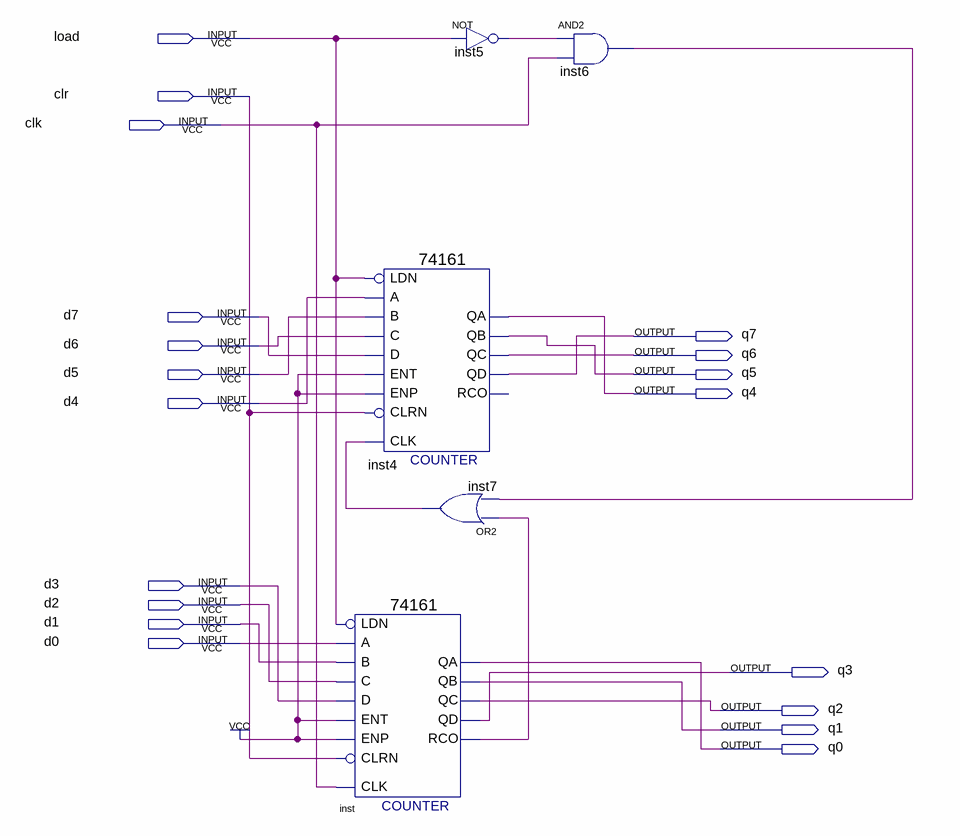
[diagram p0: schematic sheet]
// Quartus schematic newcounter.bdf as structural Verilog: 5 symbols, 19 pins
module newcounter (
  input  load,
  input  clr,
  input  clk,
  input  d7,
  input  d6,
  input  d5,
  input  d4,
  input  d3,
  input  d2,
  input  d1,
  input  d0,
  output q7,
  output q6,
  output q5,
  output q4,
  output q3,
  output q2,
  output q1,
  output q0
);

  wire inst5_out, inst6_out, inst7_out, inst_rco;

  \74161  inst4 (
    .CLRN(clr), .CLK(inst7_out), .ENP(1'b1), .LDN(load), .A(d4), .D(d7), .ENT(1'b1), .B(d5), .C(d6), .QD(q7),
    .QC(q6), .QB(q5), .QA(q4));  // open: RCO
  \74161  inst (
    .CLRN(clr), .CLK(clk), .ENP(1'b1), .LDN(load), .A(d0), .D(d3), .ENT(1'b1), .B(d1), .C(d2), .QD(q3),
    .QC(q2), .QB(q1), .QA(q0), .RCO(inst_rco));
  or inst7 (inst7_out, inst_rco, inst6_out);
  not inst5 (inst5_out, load);
  and inst6 (inst6_out, inst5_out, clk);
endmodule
